# EAGLE design 1 (EAGLE 8.2.1)
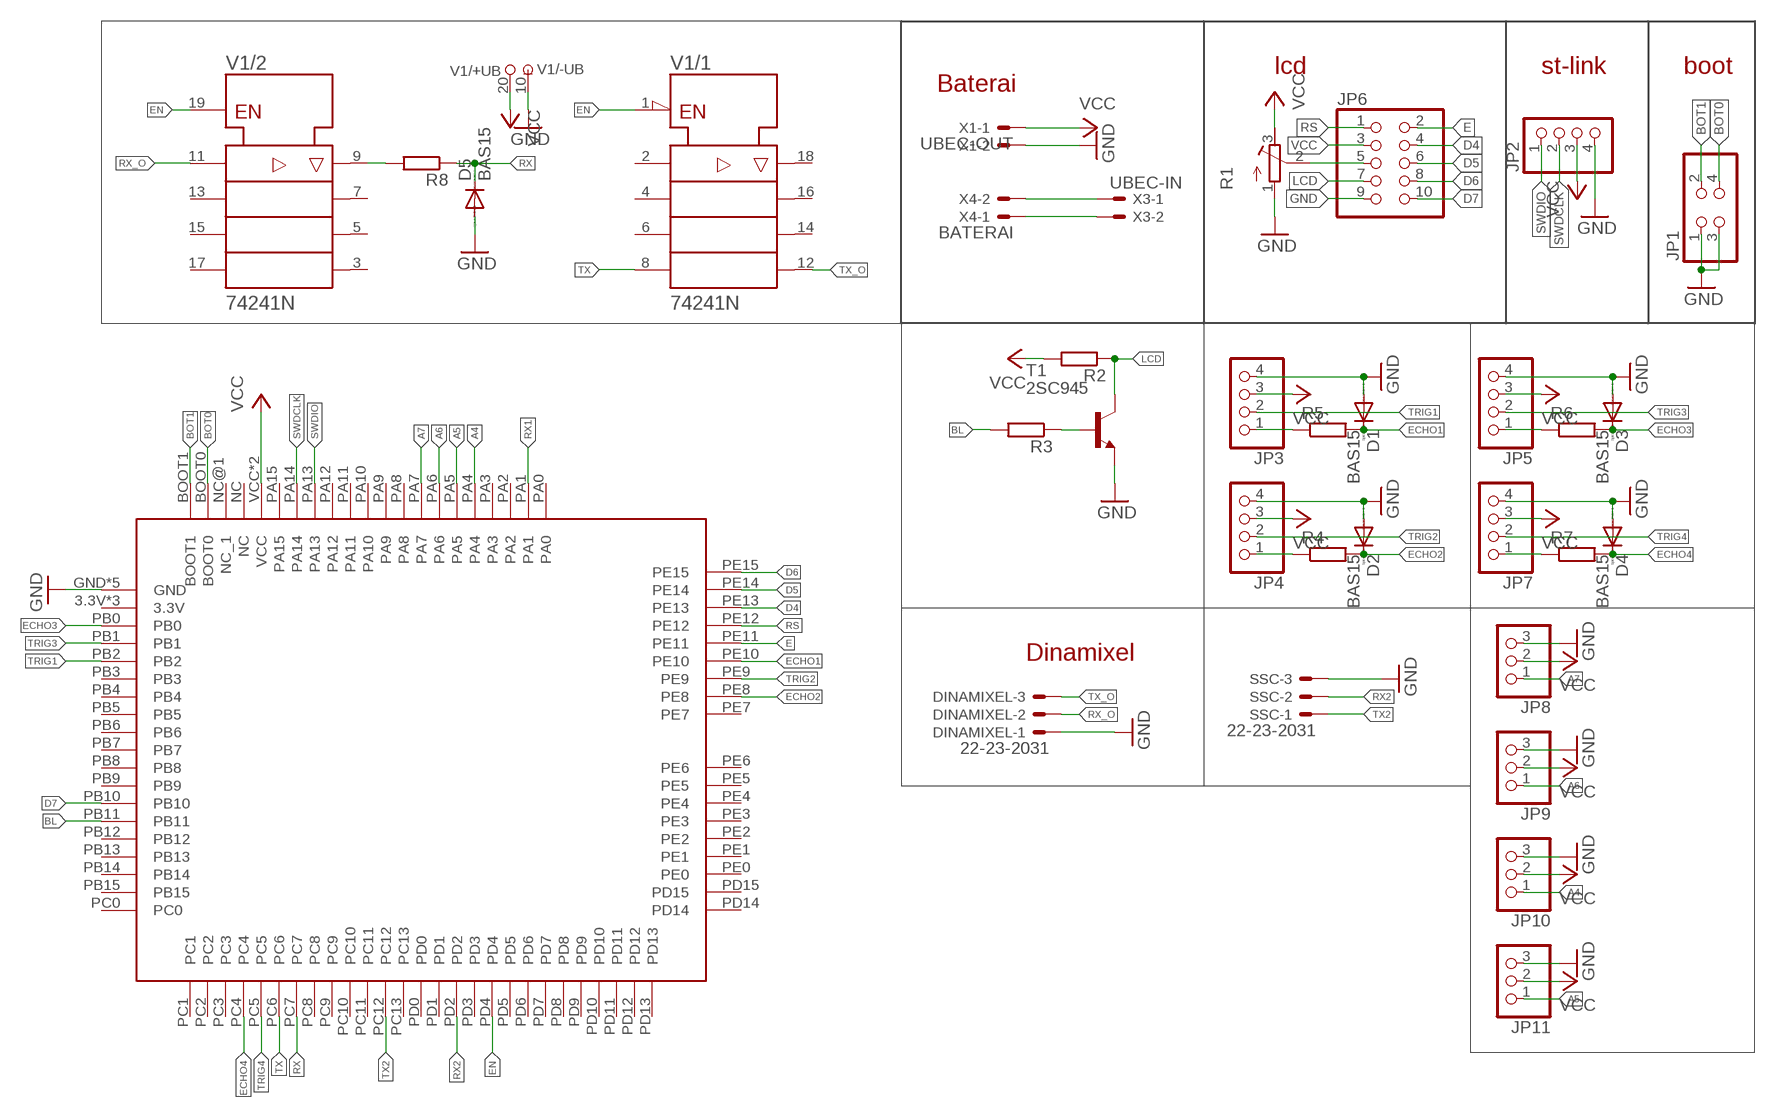
[diagram p0: schematic, sheet 1]

## Parts
D1  BAS15  [DO34-7]
D2  BAS15  [DO34-7]
D3  BAS15  [DO34-7]
D4  BAS15  [DO34-7]
D5  BAS15  [DO34-7]
DINAMIXEL  22-23-2031  [22-23-2031]
JP1  PINHD-2X2  [2X02]
JP2  PINHD-1X4  [1X04]
JP3  PINHD-1X4  [1X04]
JP4  PINHD-1X4  [1X04]
JP5  PINHD-1X4  [1X04]
JP6  PINHD-2X5  [2X05]
JP7  PINHD-1X4  [1X04]
JP8  PINHD-1X3  [1X03]
JP9  PINHD-1X3  [1X03]
JP10  PINHD-1X3  [1X03]
JP11  PINHD-1X3  [1X03]
R1  R-TRIMM3339P  [RTRIM3339P]
R2  R-EU_0207/7  [0207/7]
R3  R-EU_0207/7  [0207/7]
R4  R-EU_0207/7  [0207/7]
R5  R-EU_0207/7  [0207/7]
R6  R-EU_0207/7  [0207/7]
R7  R-EU_0207/7  [0207/7]
R8  R-EU_0207/7  [0207/7]
SSC  22-23-2031  [22-23-2031]
T1  2SC945  [TO92-ECB]
U$2  STM32F4  [STM32F4]
V1  74241N  [DIL20]
X1  UBEC-OUT  22-23-2021  [22-23-2021]
X3  UBEC-IN  22-23-2021  [22-23-2021]
X4  BATERAI  22-23-2021  [22-23-2021]

## Nets
A4: JP10.1 U$2.PA4
A5: JP11.1 U$2.PA5
A6: JP9.1 U$2.PA6
A7: JP8.1 U$2.PA7
BL: R3.2 U$2.PB11
BOT0: JP1.4 U$2.BOOT0
BOT1: JP1.2 U$2.BOOT1
D4: JP6.4 U$2.PE13
D5: JP6.6 U$2.PE14
D6: JP6.8 U$2.PE15
D7: JP6.10 U$2.PB10
E: JP6.2 U$2.PE11
ECHO1: D1.C R5.2 U$2.PE10
ECHO2: D2.C R4.2 U$2.PE8
ECHO3: D3.C R6.2 U$2.PB0
ECHO4: D4.C R7.2 U$2.PC4
EN: U$2.PD4 V1.1(/1:!G) V1.19(/2:G)
GND: D1.A D2.A D3.A D4.A D5.A DINAMIXEL.1 JP1.1 JP1.3 JP2.4 JP3.4 JP4.4 JP5.4 JP6.9 JP7.4 JP8.3 JP9.3 JP10.3 JP11.3 R1.1(A) SSC.3 T1.E U$2.GND U$2.GND@1(GND) U$2.GND@2(GND) U$2.GND@3(GND) U$2.GND@5(GND) V1.10(/-UB:-UB) X1.2
LCD: JP6.7 R2.1 T1.C
N$1: JP4.1 R4.1
N$2: R3.1 T1.B
N$3: JP3.1 R5.1
N$4: X3.1 X4.2
N$5: X3.2 X4.1
N$6: JP6.5 R1.2(S)
N$7: JP5.1 R6.1
N$8: JP7.1 R7.1
N$10: R8.2 V1.9(/2:Y1)
RS: JP6.1 U$2.PE12
RX: D5.C R8.1 U$2.PC7
RX1: U$2.PA1
RX2: SSC.2 U$2.PD2
RX_O: DINAMIXEL.2 V1.11(/2:A1)
SWDCLK: JP2.2 U$2.PA14
SWDIO: JP2.1 U$2.PA13
TRIG1: JP3.2 U$2.PB2
TRIG2: JP4.2 U$2.PE9
TRIG3: JP5.2 U$2.PB1
TRIG4: JP7.2 U$2.PC5
TX: U$2.PC6 V1.8(/1:A4)
TX2: SSC.1 U$2.PC12
TX_O: DINAMIXEL.3 V1.12(/1:Y4)
VCC: JP2.3 JP3.3 JP4.3 JP5.3 JP6.3 JP7.3 JP8.2 JP9.2 JP10.2 JP11.2 R1.3(E) R2.2 U$2.VCC U$2.VCC@1(VCC) V1.20(/+UB:+UB) X1.1
Unconnected: U$2.3.3V U$2.3.3V@2(3.3V) U$2.3.3V@3(3.3V) U$2.NC U$2.NC@1(NC_1) U$2.PA0 U$2.PA2 U$2.PA3 U$2.PA8 U$2.PA9 U$2.PA10 U$2.PA11 U$2.PA12 U$2.PA15 U$2.PB3 U$2.PB4 U$2.PB5 U$2.PB6 U$2.PB7 U$2.PB8 U$2.PB9 U$2.PB12 U$2.PB13 U$2.PB14 U$2.PB15 U$2.PC0 U$2.PC1 U$2.PC2 U$2.PC3 U$2.PC8 U$2.PC9 U$2.PC10 U$2.PC11 U$2.PC13 U$2.PD0 U$2.PD1 U$2.PD3 U$2.PD5 U$2.PD6 U$2.PD7 U$2.PD8 U$2.PD9 U$2.PD10 U$2.PD11 U$2.PD12 U$2.PD13 U$2.PD14 U$2.PD15 U$2.PE0 U$2.PE1 U$2.PE2 U$2.PE3 U$2.PE4 U$2.PE5 U$2.PE6 U$2.PE7 V1.2(/1:A1) V1.3(/2:Y4) V1.4(/1:A2) V1.5(/2:Y3) V1.6(/1:A3) V1.7(/2:Y2) V1.13(/2:A2) V1.14(/1:Y3) V1.15(/2:A3) V1.16(/1:Y2) V1.17(/2:A4) V1.18(/1:Y1)

## Notes on the sheet
- lcd | st-link | boot
- Baterai
- Dinamixel

## Library data of the parts
D1-D5 = diode:BAS15: DIODE high speed
DINAMIXEL SSC = con-molex:22-23-2031: .100" (2.54mm) Center Header - 3 Pin; MF: MOLEX; MPN: 22-23-2031; OC_FARNELL: 1462950; OC_NEWARK: 30C0862
JP1 = pinhead:PINHD-2X2: PIN HEADER
JP2-JP5 JP7 = pinhead:PINHD-1X4: PIN HEADER
JP6 = pinhead:PINHD-2X5: PIN HEADER
JP8-JP11 = pinhead:PINHD-1X3: PIN HEADER
R1 = rcl:R-TRIMM: Trimm resistor
R2-R8 = rcl:R-EU_: RESISTOR, European symbol
T1 = transistor:2SC945: NPN Silicon Epitaxial Planar Transistor Source: SEMTECH ELECTRONICS LTD. ... 2SC945 2.pdf
U$2 = STM32F407-2:STM32F4
V1 = 74ttl-din:74*241: Octal BUFFER and LINE DRIVER, 3-state
X1 X3 X4 = con-molex:22-23-2021: .100" (2.54mm) Center Header - 2 Pin; MF: MOLEX; MPN: 22-23-2021; OC_FARNELL: 1462926; OC_NEWARK: 25C3832

## Board
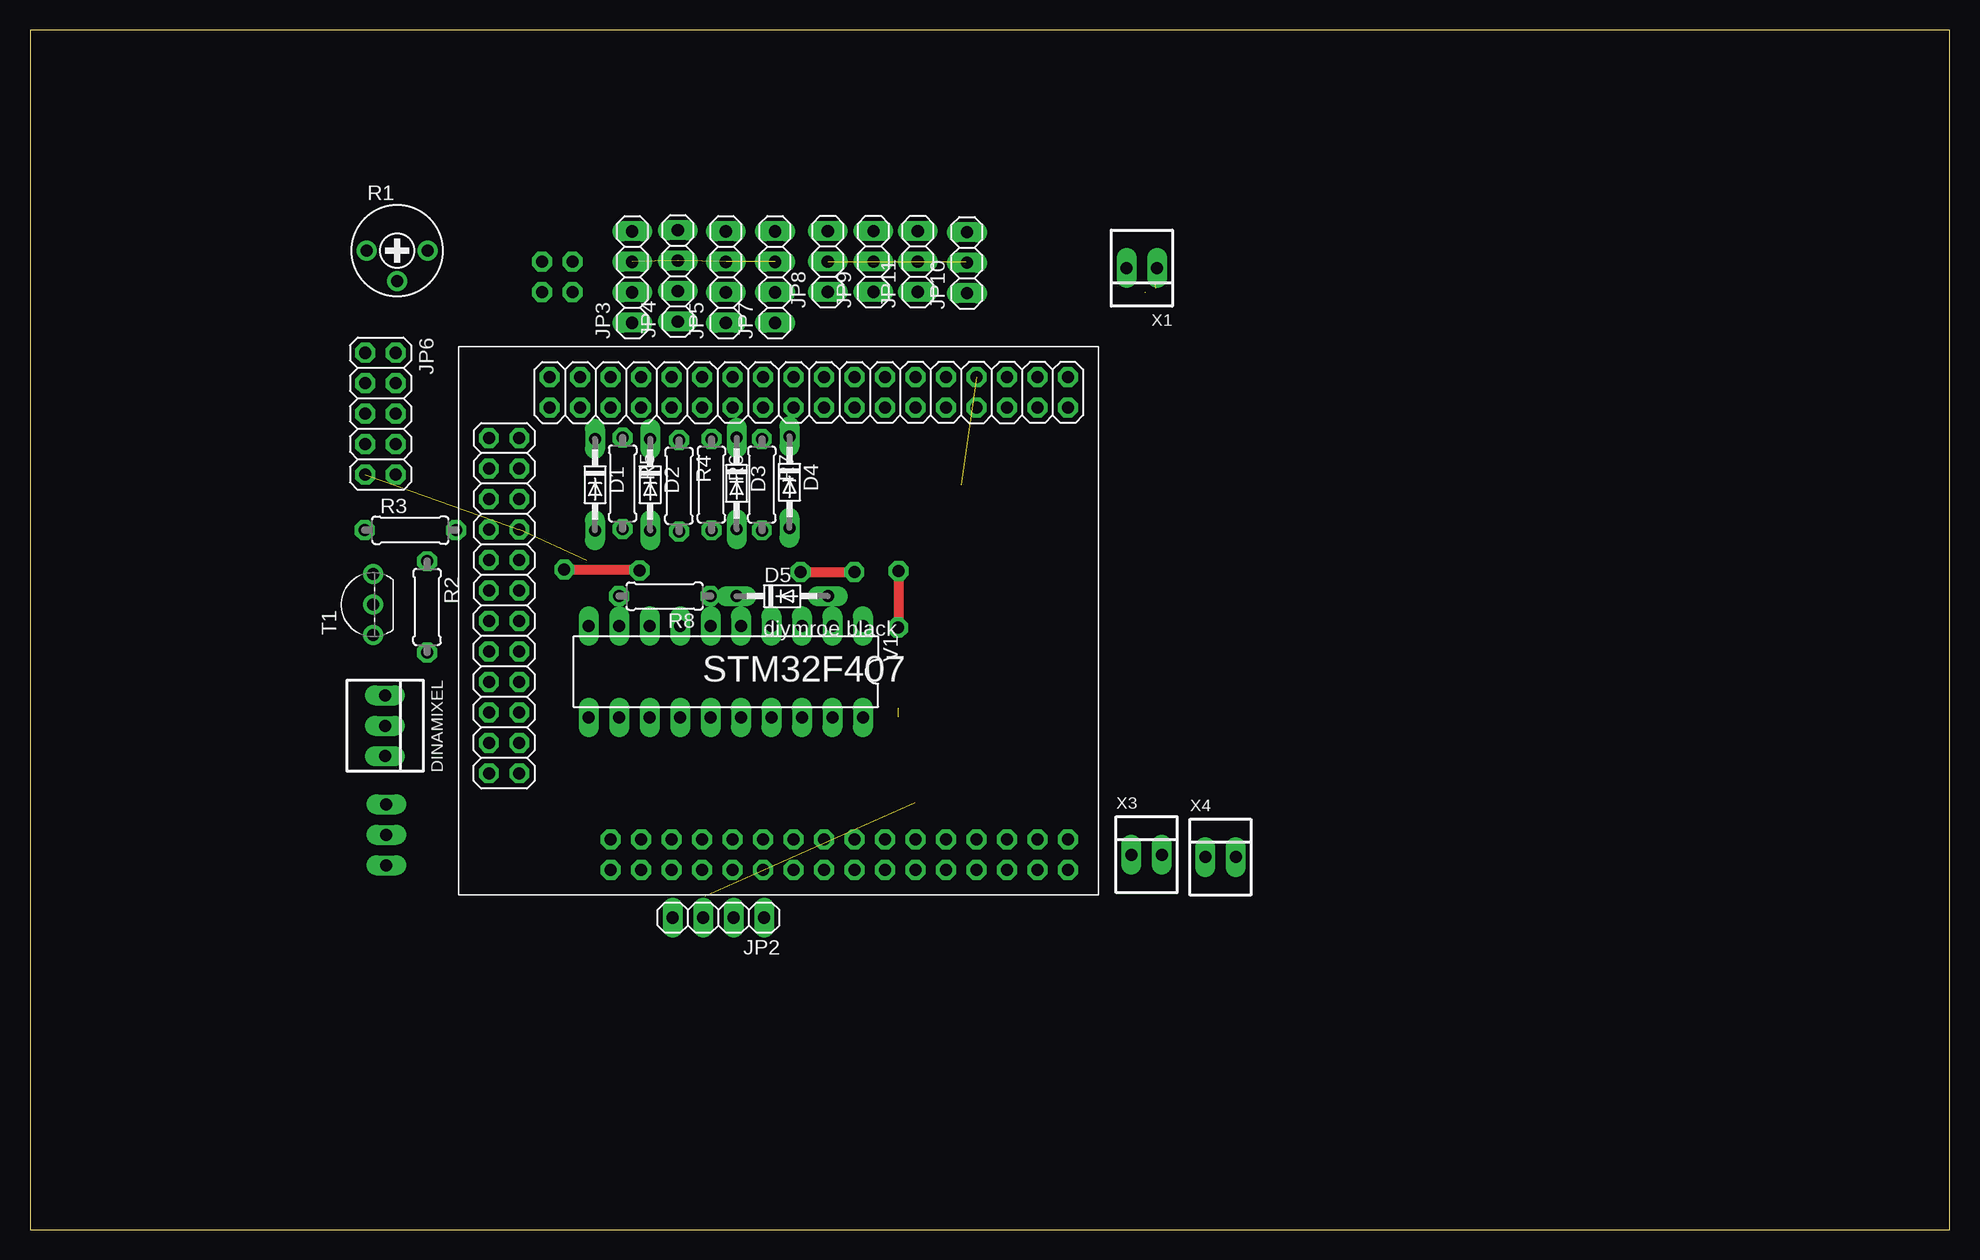
[diagram p1: board, top side]
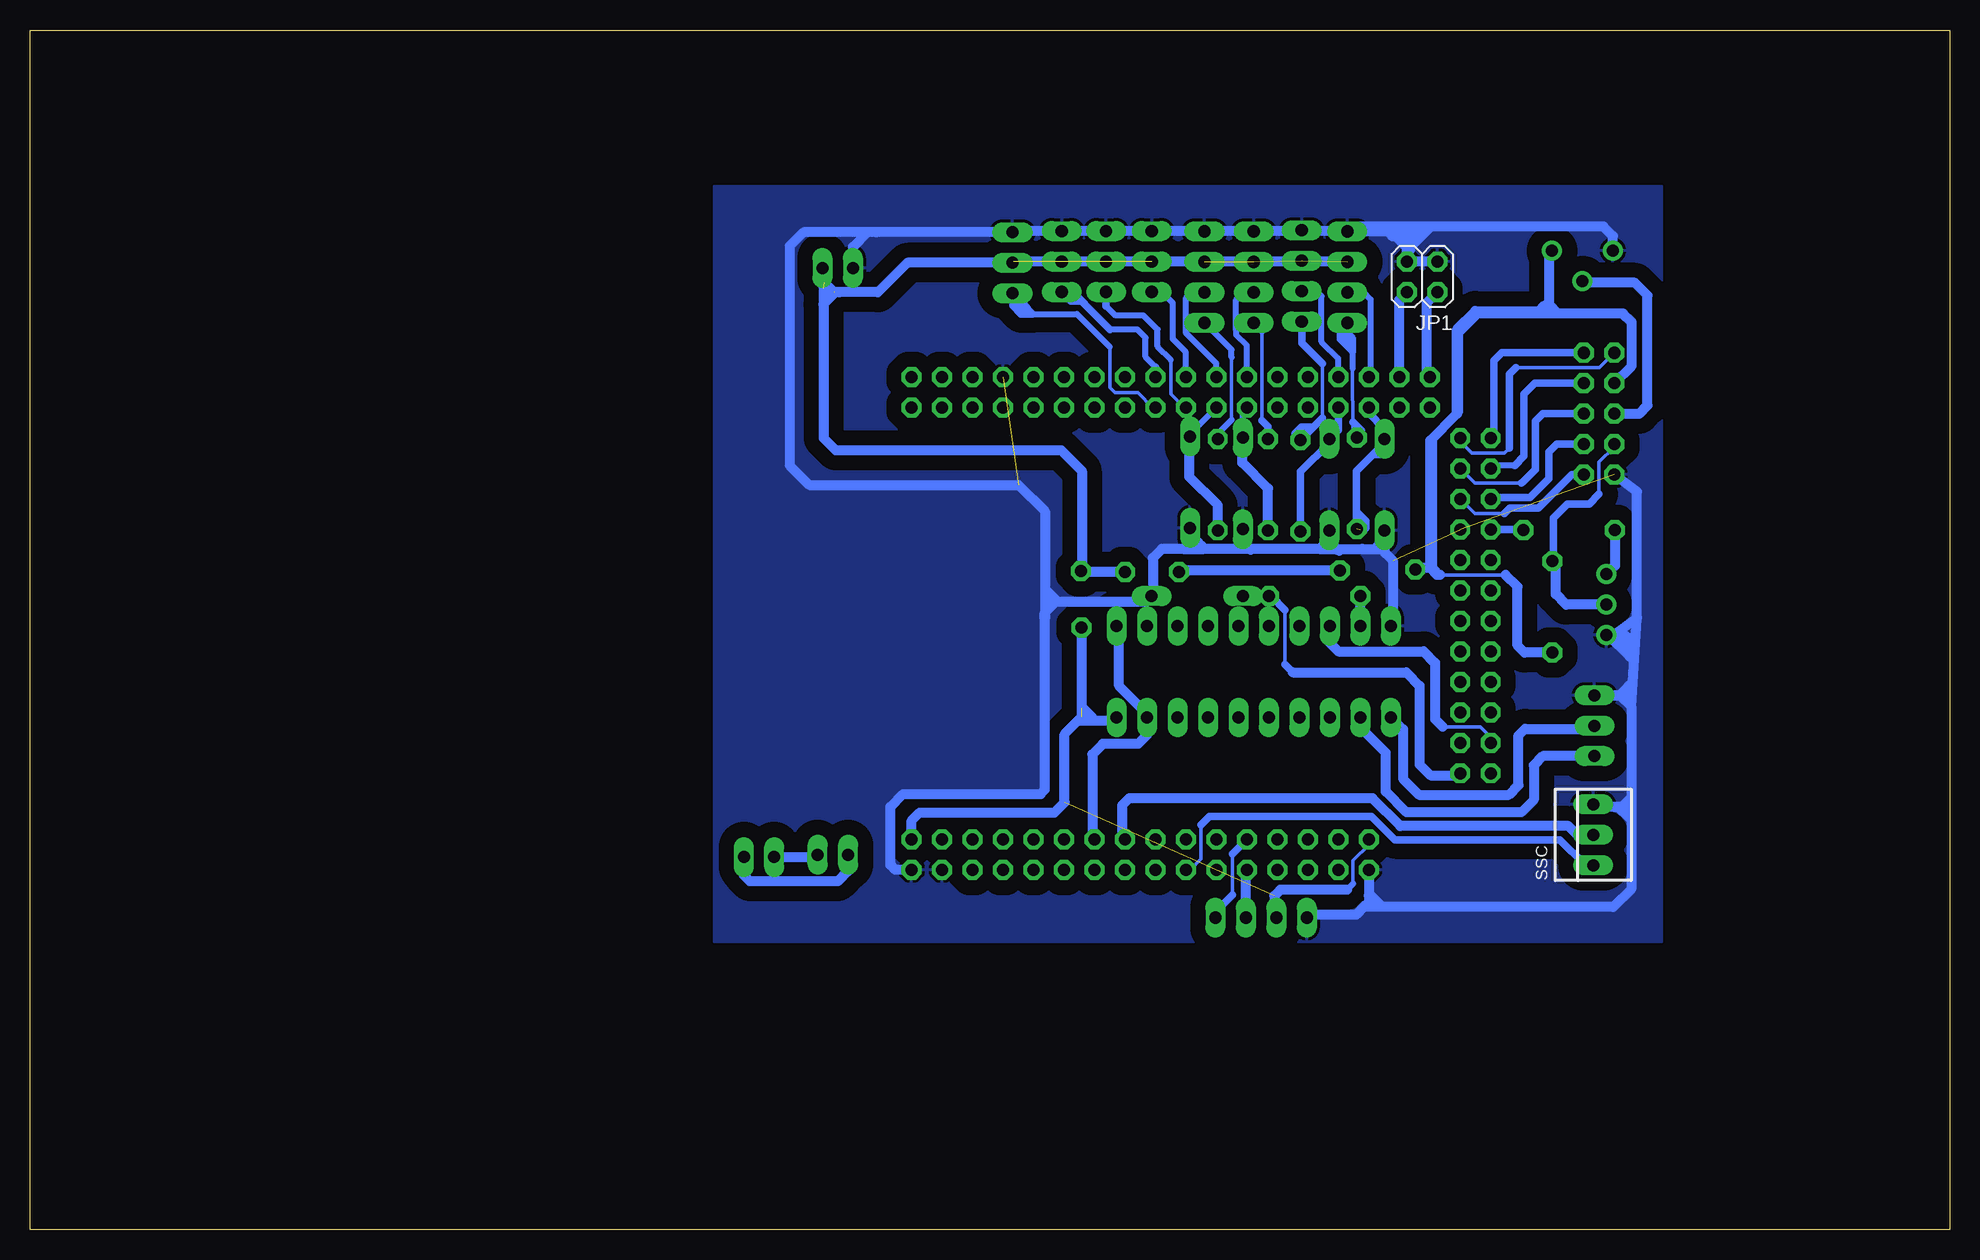
[diagram p2: board, bottom side, seen from below]

Size 160 x 100 mm. Coordinates in mm from the lower left corner, seen from the top.
Outline: 0,0 160,0 160,100 0,100 0,0
Copper layers (1*16): Top 0.035mm / dielectric 1.5mm / Bottom 0.035mm
Design rules "default *": minimum track width 6mil, minimum drill 0.35mm, track to track 6mil, track to pad 6mil, pad to pad 6mil, via to via 6mil, smd to smd 6mil, copper to edge 40mil, drill to drill 6mil, minimum pad ring 13mil, minimum via ring 13mil, stop-mask expansion 4mil, vias tented up to drill 0mil, thermal gap 10mil

### Footprints (pad centres in the part's own frame; a part is rotated, then mirrored left to right if it is on the bottom)
DO34-7 = drill 1 long: A 3.81,0; C -3.81,0
22-23-2031 = drill 1 long: 1 -2.54,0; 2 0,0; 3 2.54,0
2X02 = drill 1.016 octagon: 1 -1.27,-1.27; 2 -1.27,1.27; 3 1.27,-1.27; 4 1.27,1.27
1X04 = drill 1.016 long: 1 -3.81,0; 2 -1.27,0; 3 1.27,0; 4 3.81,0
2X05 = drill 1.016 octagon: 1 -5.08,-1.27; 2 -5.08,1.27; 3 -2.54,-1.27; 4 -2.54,1.27; 5 0,-1.27; 6 0,1.27; 7 2.54,-1.27; 8 2.54,1.27; 9 5.08,-1.27; 10 5.08,1.27
1X03 = drill 1.016 long: 1 -2.54,0; 2 0,0; 3 2.54,0
RTRIM3339P = drill 1: 1 -2.54,0; 2 0,-2.54; 3 2.54,0
0207/7 = drill 1 octagon: 1 -3.81,0; 2 3.81,0
TO92-ECB = drill 1: B 2.54,0; C 0,0; E -2.54,0
STM32F4 = drill 1 octagon: 3.3V 13.97,-16.95; 3.3V@2 -29.21,6.35; 3.3V@3 8.89,19.05; BOOT0 -24.13,21.59; BOOT1 -26.67,21.59; GND 16.51,-19.49; GND@1 13.97,-19.49; GND@2 -21.59,-19.49; GND@3 -29.21,8.89; GND@5 8.89,21.59; NC -24.13,19.05; NC@1 -26.67,19.05; PA0 3.81,21.59; PA1 1.27,19.05; PA2 1.27,21.59; PA3 -1.27,21.59; PA4 -3.81,19.05; PA5 -3.81,21.59; PA6 -6.35,19.05; PA7 -6.35,21.59; PA8 -19.05,-19.49; PA9 -16.51,-16.95; PA10 -16.51,-19.49; PA11 -13.97,-16.95; PA12 -13.97,-19.49; PA13 -11.43,-16.95; PA14 -11.43,-19.49; PA15 -8.89,-16.95; PB0 -11.43,19.05; PB1 -11.43,21.59; PB2 -21.59,21.59; PB3 6.35,-16.95; PB4 6.35,-19.49; PB5 8.89,-16.95; PB6 8.89,-19.49; PB7 11.43,-16.95; PB8 -13.97,19.05; PB9 -13.97,21.59; PB10 -29.21,11.43; PB11 -31.75,8.89; PB12 -31.75,6.35; PB13 -29.21,3.81; PB14 -31.75,3.81; PB15 -29.21,1.27; PC0 6.35,19.05; PC1 6.35,21.59; PC2 3.81,19.05; PC3 -1.27,19.05; PC4 -8.89,19.05; PC5 -8.89,21.59; PC6 -31.75,-8.89; PC7 -29.21,-11.43; PC8 -31.75,-11.43; PC9 -19.05,-16.95; PC10 -8.89,-19.49; PC11 -6.35,-16.95; PC12 -6.35,-19.49; PC13 11.43,21.59; PD0 -3.81,-16.95; PD1 -3.81,-19.49; PD2 -1.27,-16.95; PD3 -1.27,-19.49; PD4 1.27,-16.95; PD5 1.27,-19.49; PD6 3.81,-16.95; PD7 3.81,-19.49; PD8 -31.75,1.27; PD9 -29.21,-1.27; PD10 -31.75,-1.27; PD11 -29.21,-3.81; PD12 -31.75,-3.81; PD13 -29.21,-6.35; PD14 -31.75,-6.35; PD15 -29.21,-8.89; PE0 11.43,-19.49; PE1 -16.51,19.05; PE2 16.51,19.05; PE3 16.51,21.59; PE4 13.97,19.05; PE5 13.97,21.59; PE6 11.43,19.05; PE7 -16.51,21.59; PE8 -19.05,19.05; PE9 -19.05,21.59; PE10 -21.59,19.05; PE11 -31.75,16.51; PE12 -29.21,16.51; PE13 -31.75,13.97; PE14 -29.21,13.97; PE15 -31.75,11.43; VCC 16.51,-16.95; VCC@1 -21.59,-16.95
DIL20 = drill 1 long: 1 -11.43,-3.81; 2 -8.89,-3.81; 3 -6.35,-3.81; 4 -3.81,-3.81; 5 -1.27,-3.81; 6 1.27,-3.81; 7 3.81,-3.81; 8 6.35,-3.81; 9 8.89,-3.81; 10 11.43,-3.81; 11 11.43,3.81; 12 8.89,3.81; 13 6.35,3.81; 14 3.81,3.81; 15 1.27,3.81; 16 -1.27,3.81; 17 -3.81,3.81; 18 -6.35,3.81; 19 -8.89,3.81; 20 -11.43,3.81
22-23-2021 = drill 1 long: 1 -1.27,0; 2 1.27,0

### Placement (x,y rotation side)
D1  47.1,62.1 270 top
D2  51.7,62.1 270 top
D3  58.9,62.2 270 top
D4  63.3,62.3 270 top
D5  62.7,52.8 0 top
DINAMIXEL  29.6,42 270 top
JP1  43.95,79.42 180 bottom
JP2  57.38,26 180 top
JP3  50.2,79.4 90 top
JP4  54,79.5 90 top
JP5  58,79.4 90 top
JP6  29.22,68.01 270 top
JP7  62.1,79.4 90 top
JP8  66.5,80.7 90 top
JP9  70.3,80.7 90 top
JP10  78.1,80.6 90 top
JP11  74,80.7 90 top
R1  30.6,81.6 0 top
R2  33.1,51.9 270 top
R3  31.7,58.3 0 top
R4  54.1,62 270 top
R5  49.4,62.2 270 top
R6  56.8,62.1 270 top
R7  61,62.1 270 top
R8  52.9,52.8 180 top
SSC  29.7,32.9 90 bottom
T1  28.6,52.1 90 top
U$2  70,49.47 0 top
V1  58,46.5 180 top
X1  92.68,80.15 180 top
X3  93.08,31.25 0 top
X4  99.23,31.05 0 top

### Tracks (layer width: path | path; a pad name or v marks a point on that pad's centre or on a via)
A4
  Bottom 0.305: 66.42,68.52 67.66,69.76 69.56,69.76 69.98,70.18 69.98,73.57
  Bottom 0.508: 69.98,73.57 72.74,76.33 76.42,76.33
  Bottom 0.61: U$2.PA4 66.42,68.52 | 77.38,76.33 76.42,76.33 77.18,77.09 | 78.06,77.01 77.38,76.33 | 78.06,78.02 78.06,77.01 | 78.06,78.02 JP10.1 78.1,78.01 77.18,77.09 | 76.95,76.33 76.95,76.91 78.06,78.02 | 76.86,76.33 77.38,76.33 | 77.38,76.33 78.06,77.01 | 77.66,76.61 77.18,77.09 | 77.36,77.31 77.75,77.31 78.06,77.01
A5
  Bottom 0.508: 66.19,71.9 67.02,72.73 67.02,74.35 67.7,75.03 69.96,75.03
  Bottom 0.61: U$2.PA5 66.19,71.9 | 69.96,75.03 72.34,77.41 73.25,77.41 | 73.65,77.81 JP11.1 | 73.65,77.81 73.25,77.41 | 72.1,77.17 73.1,78.17 JP11.1 | JP11.1 73.65,77.81 | 72.94,78 72.94,77.72 73.25,77.41
A6
  Bottom 0.305: 63.8,68.52 64.91,69.63 64.91,72.51
  Bottom 0.508: 64.91,72.51 66.02,73.62 66.02,75.03 67.19,76.2 69.52,76.2 70.3,76.98
  Bottom 0.61: U$2.PA6 63.8,68.52 | 70.3,76.98 JP9.1
A7
  Bottom 0.508: U$2.PA7 63.65,73.14 64.74,74.23 64.74,77.25 65.46,77.97 66.31,77.97
  Bottom 0.813: 66.31,77.97 JP8.1
BL
  Bottom 0.61: U$2.PB11 35.57,58.36 R3.2
BOT0
  Bottom 0.813: U$2.BOOT0 45.87,77.5 JP1.4
BOT1
  Bottom 0.813: JP1.2 42.7,78.15 43.6,77.25 43.6,71.33 U$2.BOOT1
D4
  Bottom 0.508: 36.24,63.69 38,63.69
  Bottom 0.61: JP6.4 34.58,70.55 35.47,69.66 35.47,64.46 36.24,63.69 | 38,63.69 U$2.PE13
D5
  Bottom 0.305: 35.67,62.21 39.56,62.21 U$2.PE14
  Bottom 0.61: JP6.6 33.91,68.01 34.52,67.4 34.52,63.34 35.55,62.31 35.57,62.31 35.67,62.21
D6
  Bottom 0.61: JP6.8 32.74,65.47 33.38,64.83 33.38,62.62 34.97,61.03 38.12,61.03 U$2.PE15
D7
  Bottom 0.305: 37.09,59.69 37.75,59.69 39.58,59.69 U$2.PB10
  Bottom 0.61: JP6.10 31.48,62.93 34.27,60.14 36.64,60.14 37.09,59.69
E
  Bottom 0.61: JP6.2 37.33,73.09 37.97,72.45 37.97,66.26 U$2.PE11
ECHO1  (1 unrouted)
  Bottom 0.61: D1.C 47.1,65.57 47.38,65.3 | 47.38,65.3 49.43,63.24 49.43,58.42 R5.2 | 49.43,60.33 49.43,59.86 48.64,59.07 48.64,58.48 48.76,58.36 49.08,58.36 49.12,58.32 49.12,58.53 48.9,58.75 | 48.05,64.62 46.88,64.62 | 46.88,64.62 46.58,64.93 46.58,65.99 46.66,66.07 | 46.88,64.62 46.88,64.81 47.38,65.3 | D1.C 47.1,65.45 47.19,65.36 | U$2.PE10 48.41,68.06 47.13,66.78 47.13,65.94 D1.C
ECHO2
  Bottom 0.61: U$2.PE8 50.95,66.66 D2.C 51.7,65.58 54.11,63.17 R4.2
ECHO3
  Bottom 0.508: D3.C 58.9,68.19
  Bottom 0.61: 58.9,68.19 U$2.PB0
  Bottom 0.813: R6.2 56.8,61.79 58.94,63.93 58.94,65.97 D3.C
ECHO4
  Bottom 0.508: 63.3,66.33 U$2.PC4
  Bottom 0.813: R7.2 61,60.39 63.36,62.75 63.36,66.05 D4.C 63.3,66.33
EN
  Bottom 0.813: V1.1 69.22,50.1 69.22,45.32 66.89,42.99 V1.19 66.89,41.24 67.64,40.49 70.57,40.49 71.45,39.61 71.45,32.7 U$2.PD4
GND  (3 unrouted)
  Bottom 0.813: 52.51,56.73 59.53,56.73 | 52.51,56.73 47.91,56.73 47.66,56.98 47.65,56.98 47.1,57.53 D1.A 47.1,56.46 | 59.53,56.73 63.04,56.73 63.3,56.99 D4.A 63.3,57.33 63.9,56.73 | 59.53,56.73 58.9,57.36 D3.A 58.9,57.33 58.23,56.66 | 52.51,56.73 51.7,57.54 D2.A 51.7,57.38 50.89,56.57 | 63.9,56.73 62.15,56.73 | 63.9,56.73 65.65,56.73 66.4,55.98 66.4,52.91 D5.A 66.96,52.35 74.48,52.35 | 63.3,57.44 62.79,57.44 62.34,56.99 | 26.05,50.98 27.96,49.56 T1.E 28.46,49.56 26.66,47.76 26.66,49.18 27.21,49.73 27.21,48.98 27.15,48.92 | 26.05,50.98 26.05,61.52 JP6.9 | 26.54,43.62 26.05,50.98 | 26.54,43.62 26.54,36.02 | 26.54,36.02 27.31,35.25 29.51,35.25 SSC.3 | 26.54,43.62 27.46,44.54 DINAMIXEL.1 27.53,44.54 26.75,45.32 | U$2.GND@2 48.41,27.29 48.82,26.88 | JP2.4 53.32,26.25 49.45,26.25 48.82,26.88 | 26.54,36.02 26.54,28.37 28.03,26.88 48.82,26.88 | 48.41,27.84 48.22,27.84 47.33,26.95 | 28.04,35.25 27.64,35.25 26.75,34.36 | 48.94,56.73 47.37,56.73 47.1,56.46 | V1.10 46.41,50.47 46.41,55.77 47.03,56.39 47.1,56.46 | U$2.GND 87.88,29.98 88.28,30.38 88.28,35.25 87.22,36.31 75.77,36.31 75.42,36.66 75.42,50.9 | 75.42,50.9 75.42,51.41 74.48,52.35 | JP3.4 78.67,83.21 78.69,83.19 78.15,83.19 JP10.3 90.18,83.14 91.41,81.91 X1.2 | JP1.1 JP1.3 45.22,81.87 | 45.22,81.87 46.55,83.2 JP3.4 | R1.1 28.06,82.82 28.85,83.61 49.8,83.61 JP3.4 | 45.22,81.87 44.97,81.87 43.35,83.49 44.88,83.49 45.27,83.1 45.27,81.96 44.96,81.65 44.96,82.17 44.34,82.79 46.41,82.79 46.58,82.96 | 89.46,83.14 95.52,83.14 96.67,81.99 96.67,63.7 95.05,62.08 77.61,62.08 75.41,59.88 75.41,50.91 75.42,50.9 | 74.48,52.35 74.48,52.47 75.37,53.36
  pour Bottom (isolate 1.27): 31,87 24,87 24,24 103,24 103,87
LCD
  Bottom 0.305: 27.95,65.25 29.21,63.99 29.21,61.31
  Bottom 0.61: JP6.7 27.95,65.25 | 29.21,61.31 30.04,60.48 31.87,60.48 33.03,59.32 33.03,55.78 R2.1
  Bottom 0.813: T1.C 31.97,52.1 32.83,52.96 32.83,55.44 R2.1
N$1
  Bottom 0.305: 52.27,72.17 52.27,67.64
  Bottom 0.61: JP4.1 54,73.9 52.27,72.17 | 52.27,67.64 R4.1 54.39,65.52 54.56,65.52 54.56,66.34 54.02,66.89 53.02,66.89
N$2
  Bottom 0.813: R3.1 27.89,55.35 T1.B
N$3
  Bottom 0.305: 49.77,71.81 49.74,66.35
  Bottom 0.508: 50.2,74.8 49.75,74.35 49.76,71.79 49.77,71.81 | 49.75,73.32 49.86,73.32
  Bottom 0.61: 49.74,66.35 R5.1 49.04,66.37 49.04,66.6 49.74,67.3 | 49.86,73.32 50.79,74.25 50.79,75.76 50.75,75.8 50.41,75.8 JP3.1 50.2,74.8 50.24,74.76 50.24,73.7
N$4
  Bottom 0.813: X3.1 91.81,29.88 92.65,29.04 99.99,29.04 100.48,29.53 100.48,31.03 X4.2
N$5
  Bottom 0.813: X4.1 94.55,31.05 X3.2
N$6
  Bottom 0.813: JP6.5 25.87,68.01 25.17,68.71 25.17,77.88 26.22,78.93 30.47,78.93 R1.2
N$7
  Bottom 0.305: 57.33,67.45 57.33,74.92
  Bottom 0.61: R6.1 56.8,66.92 57.33,67.45 | 57.33,74.92 JP5.1
N$8
  Bottom 0.305: R7.1 61,66.34 | 59.85,67.49 59.85,72.72
  Bottom 0.508: 61,66.34 59.85,67.49 | 59.85,72.72 59.85,73.34 JP7.1
N$10
  Bottom 0.813: V1.9 49.11,52.78 R8.2
RS
  Bottom 0.305: 40.79,65.69 39.81,64.71 37.11,64.71 36.68,65.14 | 36.16,71.85 29.19,71.85 JP6.1
  Bottom 0.61: U$2.PE12 40.79,65.69 | 36.68,65.14 36.68,71.33 36.16,71.85
RX
  Bottom 0.305: 55.4,51.66 55.4,50.81 55.4,47.1
  Bottom 0.61: R8.1 56.54,52.8 55.4,51.66 | 55.4,47.1 54.74,46.44
  Bottom 0.813: D5.C R8.1 | D5.C 59.3,52.8 59.4,52.7 58.99,52.7 D5.C | 54.74,46.44 45.28,46.44 44.17,45.33 44.17,38.77 43.26,37.86 40.97,37.86 U$2.PC7
RX2
  Bottom 0.813: SSC.2 31.02,32.9 31.76,33.64 45.79,33.64 48.09,35.94 68.39,35.94 68.96,35.37 68.96,32.75 U$2.PD2
RX_O
  Bottom 0.813: V1.11 46.55,42.69 45.56,41.7 45.56,37.58 44.21,36.23 36.75,36.23 35.93,37.05 35.93,41.2 35.38,41.75 29.85,41.75 DINAMIXEL.2
SWDCLK
  Bottom 0.813: JP2.2 58.65,29.9 U$2.PA14
SWDIO
  Bottom 0.305: 59.78,27.9 59.78,29.48 59.78,31.31
  Bottom 0.61: JP2.1 61.19,26.49 59.78,27.9 | 59.78,31.31 U$2.PA13
TRIG1
  Bottom 0.508: JP3.2 48.83,78.13 48.26,77.56 48.26,71.21
  Bottom 0.813: 48.26,71.21 U$2.PB2
TRIG2
  Bottom 0.508: U$2.PE9 50.95,72.61 52.34,74 52.34,77.81 52.84,78.31 53.92,78.31
  Bottom 0.813: 53.92,78.31 JP4.2
TRIG3
  Bottom 0.508: U$2.PB1 58.57,73.71 59.44,74.58 59.44,74.95 59.47,74.98 59.47,77.51 59.01,77.97 58.16,77.97
  Bottom 0.813: 58.16,77.97 JP5.2
TRIG4
  Bottom 0.508: U$2.PC5 61.11,72.2 63.63,74.72 63.63,77.68 63.25,78.06 62.17,78.06
  Bottom 0.813: 62.17,78.06 JP7.2
TX
  Bottom 0.305: 42.23,41.91 41.29,41.91 39.09,41.91 38.47,41.29 38.47,40.8 U$2.PC6
  Bottom 0.813: V1.8 51.65,48.9 50.94,48.19 43.83,48.19 42.88,47.24 42.88,42.56 42.23,41.91
TX2
  Bottom 0.305: 63.28,29.98 62.38,30.88 62.38,33.74
  Bottom 0.61: U$2.PC12 63.28,29.98 | 62.38,33.74 61.67,34.45 48.2,34.45 46.24,32.49 32.48,32.49 30.41,30.42 29.76,30.42 SSC.1
TX_O
  Bottom 0.813: DINAMIXEL.3 33.89,39.46 34.66,38.69 34.66,35.82 35.7,34.78 45.27,34.78 47,36.51 47,39.74 48.7,41.44 48.7,42.28 V1.12
VCC  (via drill 1)  (10 unrouted)
  Top 0.813: v72.41,54.89 72.41,50.24 v72.34,50.17 | v44.54,55.03 50.74,55.03 v50.82,54.95 | v64.22,54.83 v68.7,54.83 v68.71,54.82
  Bottom 0.305: 48.41,32.06 49.71,30.76 49.71,28.83 | 37.01,54.58 42.45,54.58
  Bottom 0.508: U$2.VCC@1 48.41,32.06 | 49.71,28.83 50.22,28.32
  Bottom 0.61: 42.45,54.58 43.04,55.17 43.04,66.01 40.87,68.18 40.87,74.87 | 50.18,80.69 JP3.3
  Bottom 0.813: JP6.3 27.93,70.55 26.5,71.98 26.5,75.66 27.21,76.37 32.68,76.37 | 32.68,76.37 33.36,77.05 | 33.36,77.05 33.36,81.38 R1.3 | 50.22,28.32 55.79,28.32 56.29,27.82 56.29,26.18 JP2.3 | R2.2 35.42,48.09 36.02,48.69 36.02,53.59 37.01,54.58 | U$2.VCC 86.51,34.09 85.84,34.76 74.62,34.76 73.77,35.61 73.77,41.31 72.66,42.42 | 72.66,42.42 69.7,42.42 V1.20 | JP3.3 78.03,80.67 JP10.2 86.87,80.6 89.33,78.14 93.51,78.14 93.85,78.48 | 32.68,76.37 39.37,76.37 40.87,74.87 | 33.36,77.05 33.71,77.05 34.22,76.54 | 93.85,78.48 93.85,80.05 X1.1 | 93.85,78.48 93.85,65.96 92.85,64.96 74.06,64.96 72.33,63.23 72.33,54.97 v72.41,54.89 72.34,54.82 v68.71,54.82 | v72.34,50.17 72.34,42.74 72.66,42.42 | 72.34,43.47 72.22,43.47 71.49,42.74 | 42.45,54.58 42.74,54.58 43.29,55.13 | 43.29,55.13 43.29,65.78 41.06,68.01 41.06,75.06 39.54,76.58 33.87,76.58 33.72,76.73 | 43.29,55.13 44.44,55.13 v44.54,55.03 | v50.82,54.95 64.1,54.95 v64.22,54.83 | 92.54,78.14 92.99,78.14 93.79,78.94 | 92.95,78.14 92.95,78.06 93.89,77.12